# EasyEDA schematic bleeding_edge-full_control.json
TITLE: BE Rancilio-PID - FULL CONTROL; REV: 0.2; Date: 2021-03-13; Sheet: 1/1; Company: bleeding edge rancilio-pid
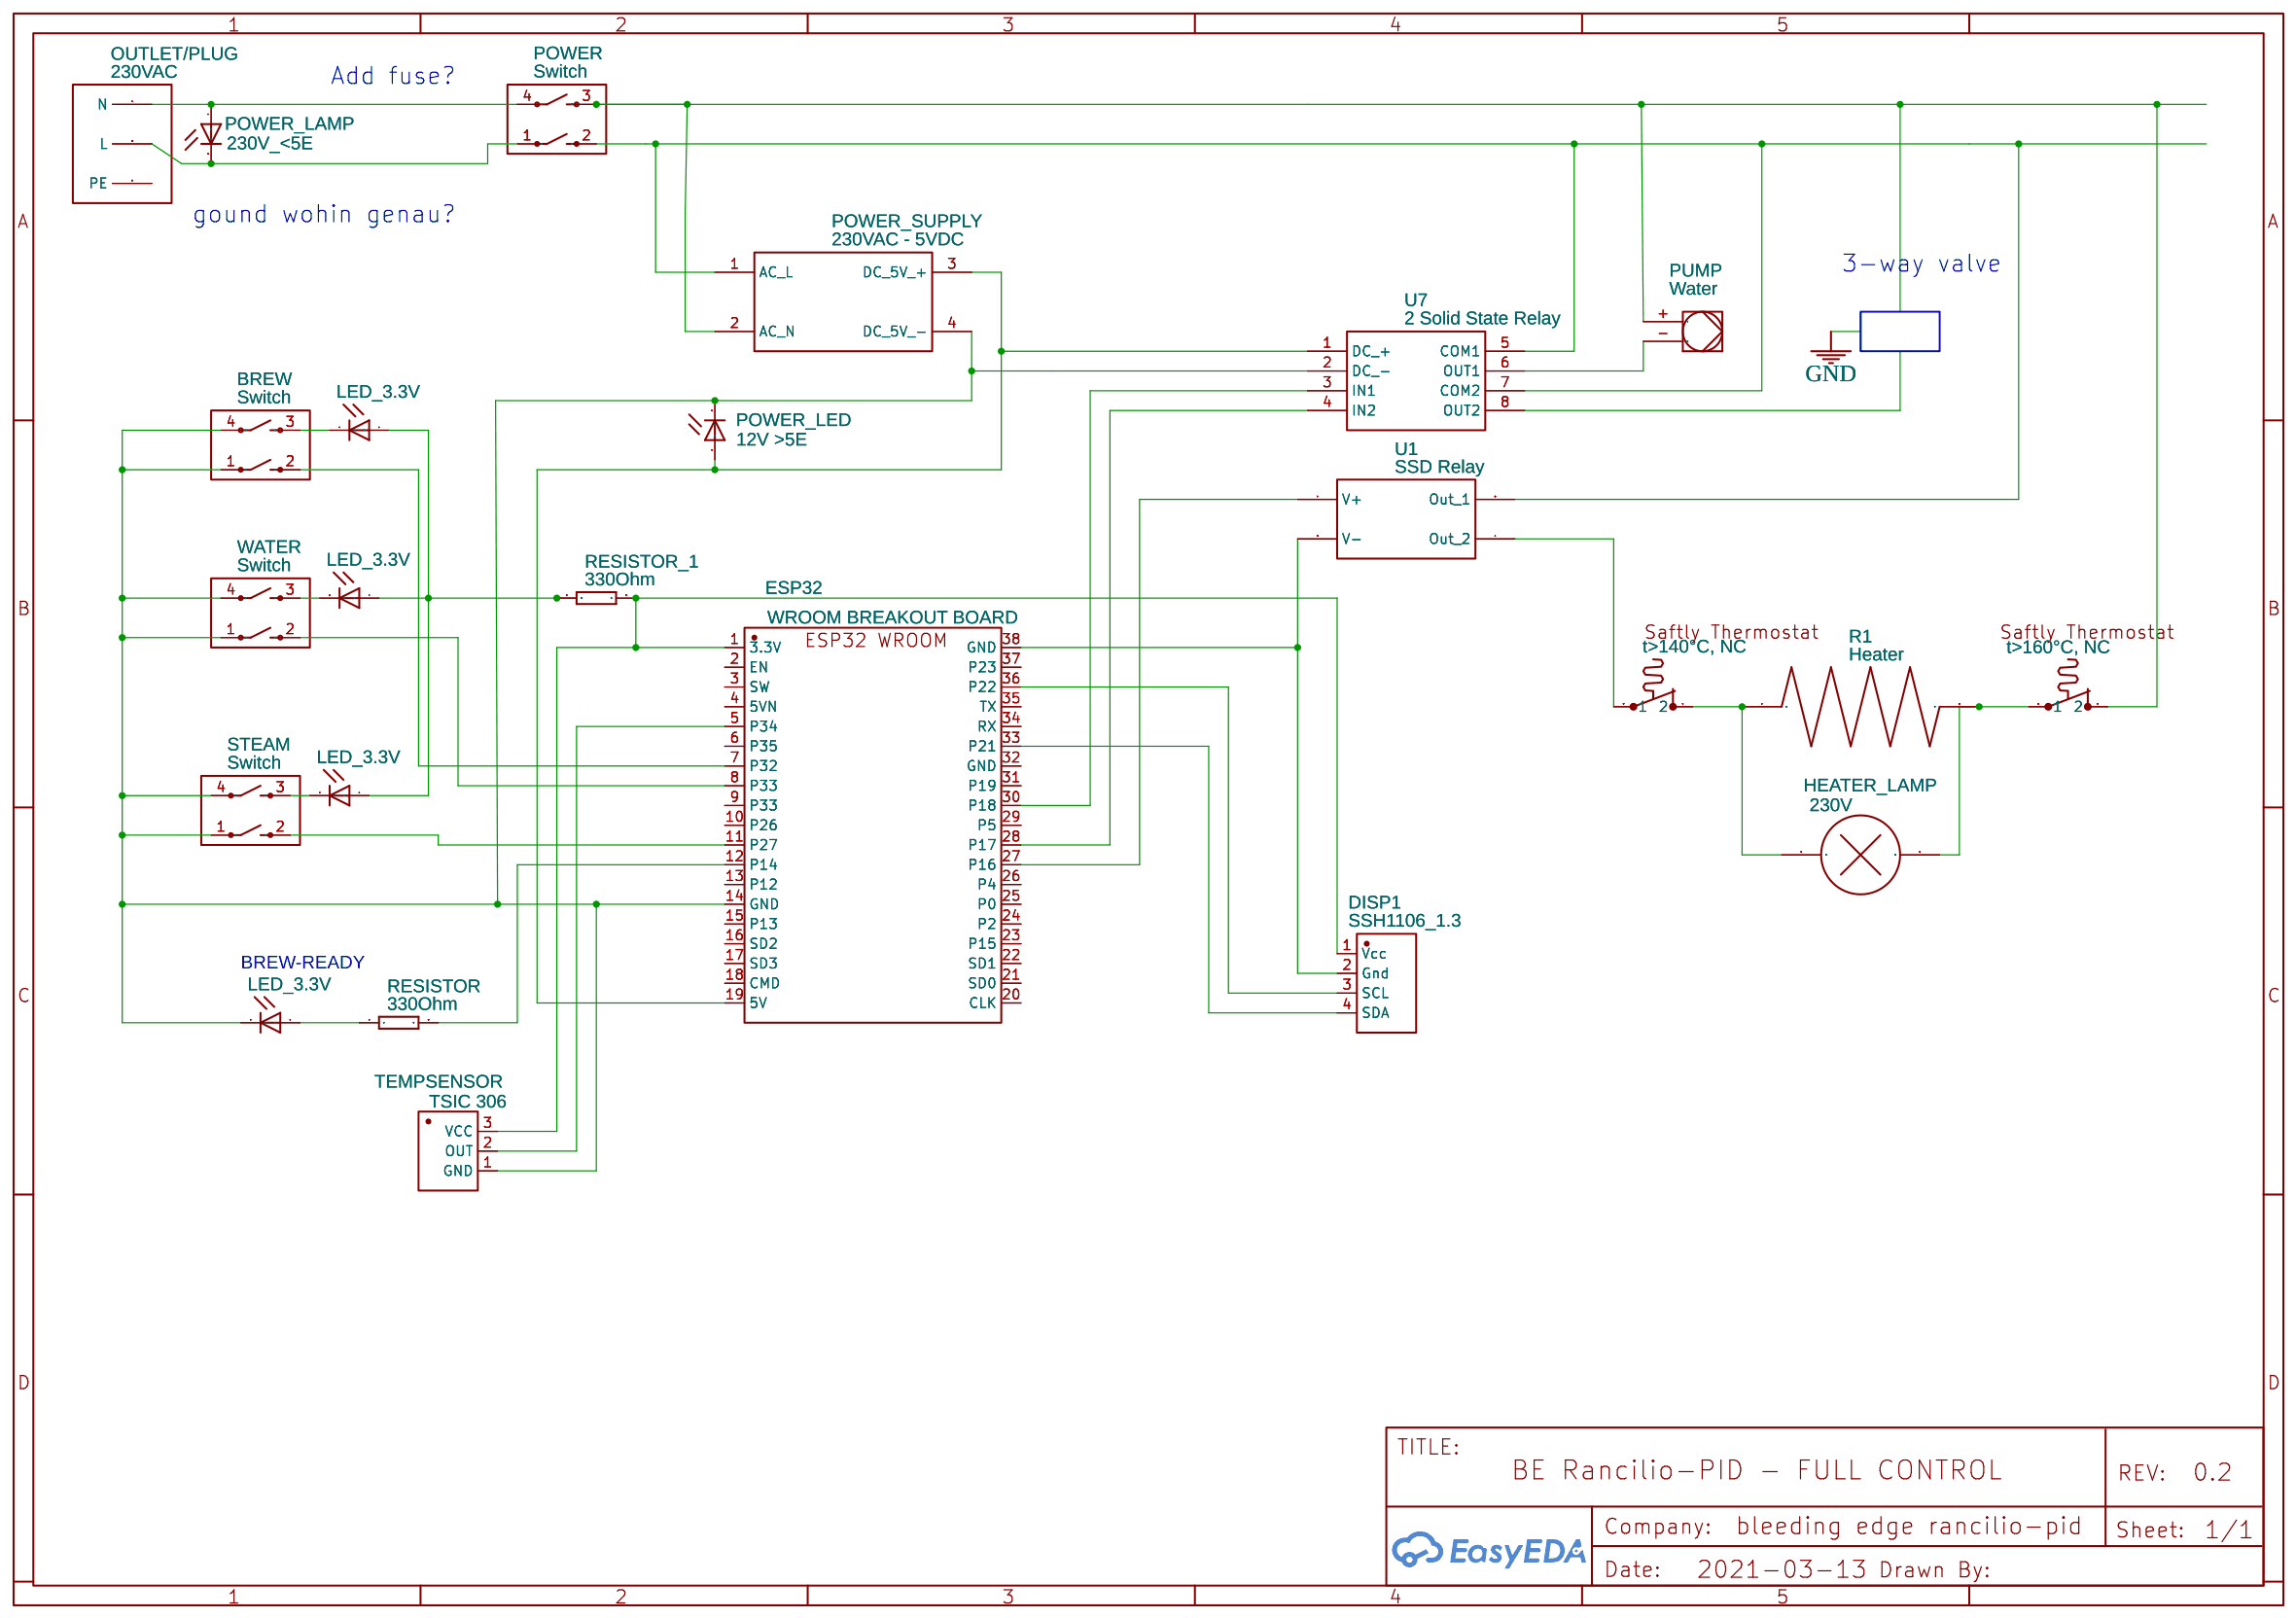
[diagram p0: schematic sheet]

## Parts
BREW  Switch  [KEY-TH_4P-L12.0-W12.0-P5.00-LS13.4]
DISP1  SSH1106_1.3  [SSH1106 1.3IN 128X64 I2C (HOLES)]
ESP32  WROOM BREAKOUT BOARD
HEATER_LAMP  230V
LED1  LED_3.3V  [LED-5MM]
LED2  LED_3.3V  [LED-5MM]
LED3  LED_3.3V  [LED-5MM]
LED4  LED_3.3V  [LED-5MM]
OUTLET/PLUG  230VAC
POWER  Switch  [KEY-TH_4P-L12.0-W12.0-P5.00-LS13.4]
POWER_LAMP  230V_<5E  [LED-5MM]
POWER_LED  12V >5E  [LED-5MM]
POWER_SUPPLY  230VAC - 5VDC  [230VAC - 5VDC]
PUMP  Water  [VIBE-MOTOR-10MM]
R1  Heater  [0805]
RESISTOR  330Ohm  [R805]
RESISTOR_1  330Ohm  [R805]
STEAM  Switch  [KEY-TH_4P-L12.0-W12.0-P5.00-LS13.4]
TEMPSENSOR  TSIC 306  [ONSC-TO-92-3-135AC]
U1  SSD Relay
U6  t>140°C, NC
U7  2 Solid State Relay  [2 SOLID STATE RELAY]
U11  t>160°C, NC
WATER  Switch  [KEY-TH_4P-L12.0-W12.0-P5.00-LS13.4]

## Library data of the parts
BREW POWER STEAM WATER = Rancilio Switch: Manufacturer: rancilio; Supplier Part: C14121; Contributor: medlor
DISP1 = SSH1106_1.3: Manufacturer Part: Tribium; Contributor: madias
ESP32 = ESP32 WROOM BREAKOUT BOARD: Contributor: bnyacuma
HEATER_LAMP = Light: Contributor: Guest
LED1-LED4 POWER_LAMP POWER_LED = LED: Contributor: DangerousPrototype
OUTLET/PLUG = 230VAC OUTLET/PLUG: Contributor: Niklas W.; Supplier Part: undefined; Supplier: sss
POWER_SUPPLY = 230VAC - 5VDC: Contributor: sanderronde
PUMP = pump: Contributor: Ivanpietropaolo
R1 = Heater: Contributor: J.cruz; Supplier: Automation Direct
RESISTOR RESISTOR_1 = RESISTOR: Contributor: DangerousPrototype
TEMPSENSOR = TSIC506F: Manufacturer: IST AG; Manufacturer Part: Innovative Sensor Technology; link: www.ist-ag.com; Contributor: ksandersify
U1 = SSD Relay: Contributor: gerenti86
U6 U11 = termostat NC: Manufacturer Part: Thermostat; Contributor: Elektrycy Ana; Supplier: TME
U7 = 2 Solid State Relay: Contributor: i.kamsai

## Nets
Net-(BREW-1): BREW.1 BREW.4 ESP32.14(GND) LED1.K(C) POWER_LED.K(C) POWER_SUPPLY.4(DC 5V -) STEAM.1 STEAM.4 TEMPSENSOR.1(GND) U7.2(DC -) WATER.1 WATER.4
Net-(BREW-2): BREW.2 ESP32.7(P32)
Net-(BREW-3): BREW.3 LED2.K(C)
Net-(DISP1-1): DISP1.1(Vcc) ESP32.1(3.3V) RESISTOR_1.2 TEMPSENSOR.3(VCC)
Net-(DISP1-2): DISP1.2(Gnd) ESP32.38(GND) U1.2(V-)
Net-(DISP1-3): DISP1.3(SCL) ESP32.36(P22)
Net-(DISP1-4): DISP1.4(SDA) ESP32.33(P21)
Net-(ESP32-5): ESP32.5(P34) TEMPSENSOR.2(OUT)
Net-(ESP32-8): ESP32.8(P33) WATER.2
Net-(ESP32-11): ESP32.11(P27) STEAM.2
Net-(ESP32-12): ESP32.12(P14) RESISTOR.2
Net-(ESP32-19): ESP32.19(5V) POWER_LED.A POWER_SUPPLY.3(DC 5V +) U7.1(DC +)
Net-(ESP32-27): ESP32.27(P16) U1.1(V+)
Net-(ESP32-28): ESP32.28(P17) U7.4(IN2)
Net-(ESP32-30): ESP32.30(P18) U7.3(IN1)
Net-(HEATER_LAMP-1): HEATER_LAMP.1 R1.2 U11.2(1)
Net-(HEATER_LAMP-2): HEATER_LAMP.2 R1.1 U6.1(2)
Net-(LED1-A): LED1.A RESISTOR.1
Net-(LED2-A): LED2.A LED3.A LED4.A RESISTOR_1.1
Net-(LED3-K): LED3.K(C) WATER.3
Net-(LED4-K): LED4.K(C) STEAM.3
Net-(OUTLET/PLUG-1): OUTLET/PLUG.1(N) POWER.4 POWER_LAMP.A
Net-(OUTLET/PLUG-2): OUTLET/PLUG.2(L) POWER.1 POWER_LAMP.K(C)
Net-(POWER-2): POWER.2 POWER_SUPPLY.1(AC L) U1.3(Out 1) U7.5(COM1) U7.7(COM2)
Net-(POWER-3): POWER.3 POWER_SUPPLY.2(AC N) PUMP.+(1) U11.1(2)
Net-(PUMP--): PUMP.-(2) U7.6(OUT1)
Net-(U1-4): U1.4(Out 2) U6.2(1)

Not connected (* = marked no-connect by the designer): ESP32 2(EN) 3(SW) 4(5VN) 6(P35) 9(P33) 10(P26) 13(P12) 15(P13) 16(SD2) 17(SD3) 18(CMD) 20(CLK) 21(SD0) 22(SD1) 23(P15) 24(P2) 25(P0) 26(P4) 29(P5) 31(P19) 32(GND) 34(RX) 35(TX) 37(P23); OUTLET/PLUG 3(PE); U7 8(OUT2)

## Notes on the sheet
- Add fuse?
- gound wohin genau?
- 3-way valve
- BREW-READY
